# EAGLE schematic untitled (EAGLE 7.2.0)
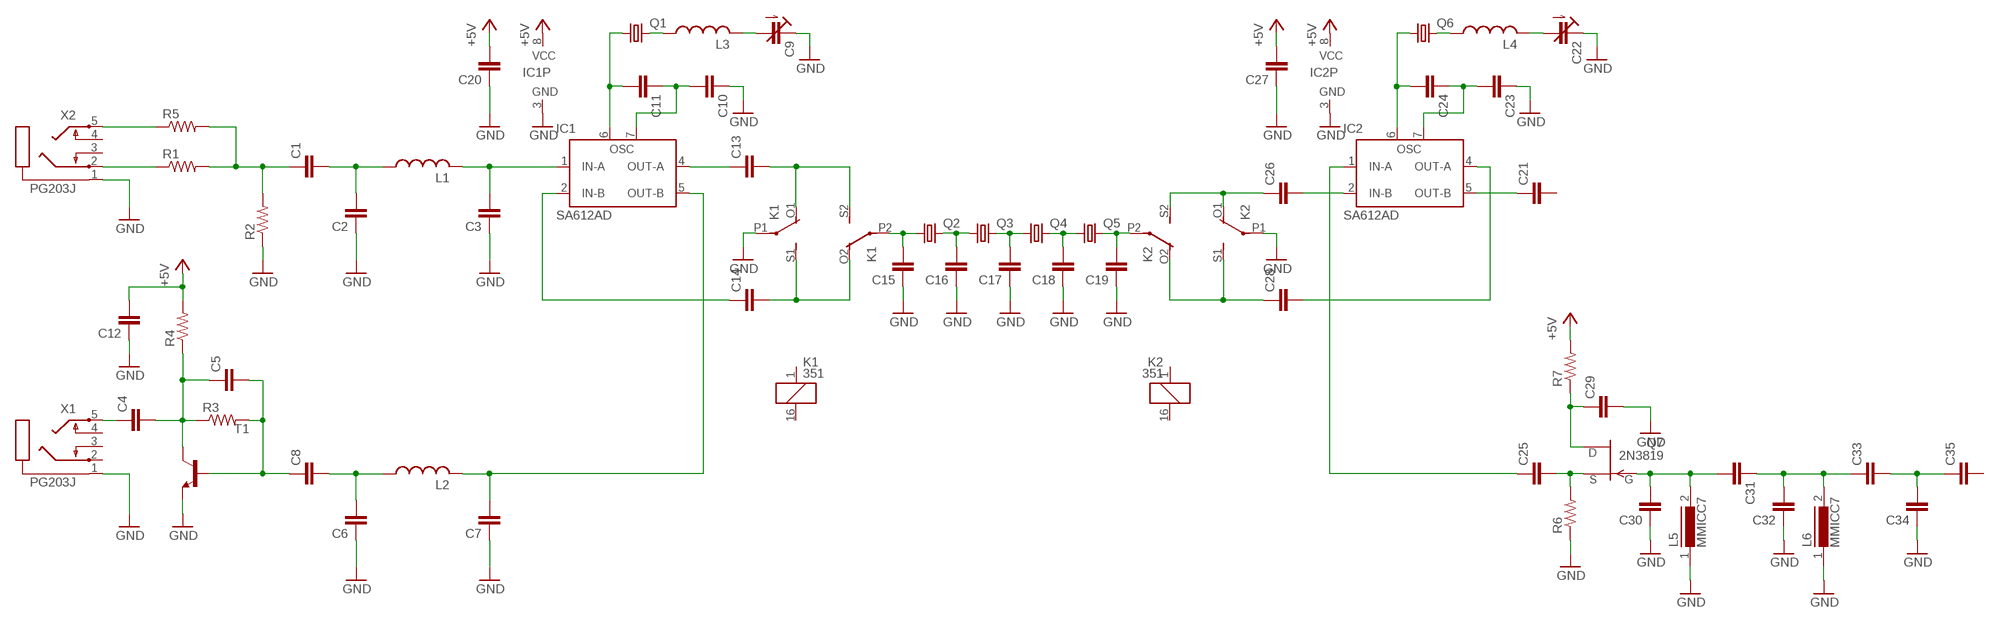
[diagram p0: schematic, sheet 1]

## Parts
C1  C-EUC0805K  [C0805K]
C2  C-EUC0805K  [C0805K]
C3  C-EUC0805K  [C0805K]
C4  C-EUC0805K  [C0805K]
C5  C-EUC0805K  [C0805K]
C6  C-EUC0805K  [C0805K]
C7  C-EUC0805K  [C0805K]
C8  C-EUC0805K  [C0805K]
C9  C-TRIMMTZ03  [CTRIMTZ03]
C10  C-EUC0805K  [C0805K]
C11  C-EUC0805K  [C0805K]
C12  C-EUC0805K  [C0805K]
C13  C-EUC0805K  [C0805K]
C14  C-EUC0805K  [C0805K]
C15  C-EUC0805K  [C0805K]
C16  C-EUC0805K  [C0805K]
C17  C-EUC0805K  [C0805K]
C18  C-EUC0805K  [C0805K]
C19  C-EUC0805K  [C0805K]
C20  C-EUC0805K  [C0805K]
C21  C-EUC0805K  [C0805K]
C22  C-TRIMMTZ03  [CTRIMTZ03]
C23  C-EUC0805K  [C0805K]
C24  C-EUC0805K  [C0805K]
C25  C-EUC0805K  [C0805K]
C26  C-EUC0805K  [C0805K]
C27  C-EUC0805K  [C0805K]
C28  C-EUC0805K  [C0805K]
C29  C-EUC0805K  [C0805K]
C30  C-EUC0805K  [C0805K]
C31  C-EUC0805K  [C0805K]
C32  C-EUC0805K  [C0805K]
C33  C-EUC0805K  [C0805K]
C34  C-EUC0805K  [C0805K]
C35  C-EUC0805K  [C0805K]
IC1  SA612AD  [SO08]
IC2  SA612AD  [SO08]
K1  351  [351]
K2  351  [351]
L1  L-US0204/7  [0204/7]
L2  L-US0204/7  [0204/7]
L3  L-US0204/7  [0204/7]
L4  L-US0204/7  [0204/7]
L5  MMICC7  [MMICC7]
L6  MMICC7  [MMICC7]
Q1  CRYSTALHC49S  [HC49/S]
Q2  CRYSTALHC49S  [HC49/S]
Q3  CRYSTALHC49S  [HC49/S]
Q4  CRYSTALHC49S  [HC49/S]
Q5  CRYSTALHC49S  [HC49/S]
Q6  CRYSTALHC49S  [HC49/S]
Q7  2N3819  [TO92]
R1  R-US_R0805  [R0805]
R2  R-US_R0805  [R0805]
R3  R-US_R0805  [R0805]
R4  R-US_R0805  [R0805]
R5  R-US_R0805  [R0805]
R6  R-US_R0805  [R0805]
R7  R-US_R0805  [R0805]
T1  MMBT3904LT1-NPN-SOT23-BEC  [SOT23-BEC]
X1  PG203J  [PG203J]
X2  PG203J  [PG203J]

## Nets
+5V: C12.2 C20.2 C27.2 IC1.8(VCC) IC2.8(VCC) R4.2 R7.2
GND: C2.1 C3.1 C6.1 C7.1 C9.1(E) C10.1 C12.1 C15.1 C16.1 C17.1 C18.1 C19.1 C20.1 C22.1(E) C23.1 C27.1 C29.2 C30.1 C32.1 C34.1 IC1.3(GND) IC2.3(GND) K1.P1(2:P) K2.P1(2:P) L5.1 L6.1 R2.1 R6.1 T1.E X1.1 X2.1
N$1: R1.1 X2.2
N$2: C1.1 R1.2 R2.2 R5.2
N$3: C1.2 C2.2 L1.1
N$4: C3.2 IC1.1(IN-A) L1.2
N$5: C4.1 X1.5
N$6: C4.2 C5.1 R3.1 R4.1 T1.C
N$7: C5.2 C8.1 R3.2 T1.B
N$8: C6.2 C8.2 L2.1
N$9: C7.2 IC1.5(OUT-B) L2.2
N$10: C11.2 IC1.6(OSC) Q1.1
N$11: L3.1 Q1.2
N$12: C9.2(A) L3.2
N$13: C10.2 C11.1 IC1.7(OSC')
N$14: C14.1 IC1.2(IN-B)
N$15: C13.1 IC1.4(OUT-A)
N$16: C13.2 K1.O1(2:O) K1.S2(3:S)
N$17: C14.2 K1.O2(3:O) K1.S1(2:S)
N$18: R5.1 X2.5
N$19: C15.2 K1.P2(3:P) Q2.1
N$20: C16.2 Q2.2 Q3.1
N$21: C17.2 Q3.2 Q4.1
N$22: C18.2 Q4.2 Q5.1
N$23: C19.2 K2.P2(3:P) Q5.2
N$24: C21.1 IC2.5(OUT-B)
N$25: C25.1 IC2.1(IN-A)
N$26: C24.2 IC2.6(OSC) Q6.1
N$27: L4.1 Q6.2
N$28: C22.2(A) L4.2
N$29: C23.2 C24.1 IC2.7(OSC')
N$30: C28.2 IC2.4(OUT-A)
N$31: C28.1 K2.O2(3:O) K2.S1(2:S)
N$32: C26.1 K2.O1(2:O) K2.S2(3:S)
N$33: C26.2 IC2.2(IN-B)
N$34: C25.2 Q7.3(S) R6.2
N$35: C29.1 Q7.1(D) R7.1
N$36: C30.2 C31.2 L5.2 Q7.2(G)
N$37: C31.1 C32.2 C33.1 L6.2
N$38: C33.2 C34.2 C35.1
Unconnected: C21.2 C35.2 K1.1 K1.16 K2.1 K2.16 X1.2 X1.3 X1.4 X2.3 X2.4

## Library data of the parts
C1-C8 C10-C21 C23-C35 = rcl:C-EU: CAPACITOR, European symbol
C9 C22 = rcl:C-TRIMM: Trimm capacitor
IC1 IC2 = linear:SA612A: Double-balanced mixer and oscillator NE612/SA612 Source: www-eu2.semiconductors.philips.com/acrobat/datasheets/SA612A.pdf
K1 K2 = relay:351: RELAY 2 x switch, Omron; OC_FARNELL: unknown; OC_NEWARK: unknown
L1-L4 = rcl:L-US: INDUCTOR, American symbol
L5 L6 = inductors:MMICC7: INDUCTOR
Q1-Q6 = crystal:CRYSTAL: CRYSTAL; OC_FARNELL: 1667008; OC_NEWARK: unknown
Q7 = transistor-fet:2N3819: N-Channel Junction FET
R1-R7 = rcl:R-US_: RESISTOR, American symbol
T1 = transistor-neu-to92:*-NPN-: NPN Transistror
X1 X2 = con-hirschmann:PG203J: MIC/HEADPHONE JACK KS-S stereo microphone/headphone jack PG203JN (Schukat); OC_FARNELL: unknown; OC_NEWARK: unknown